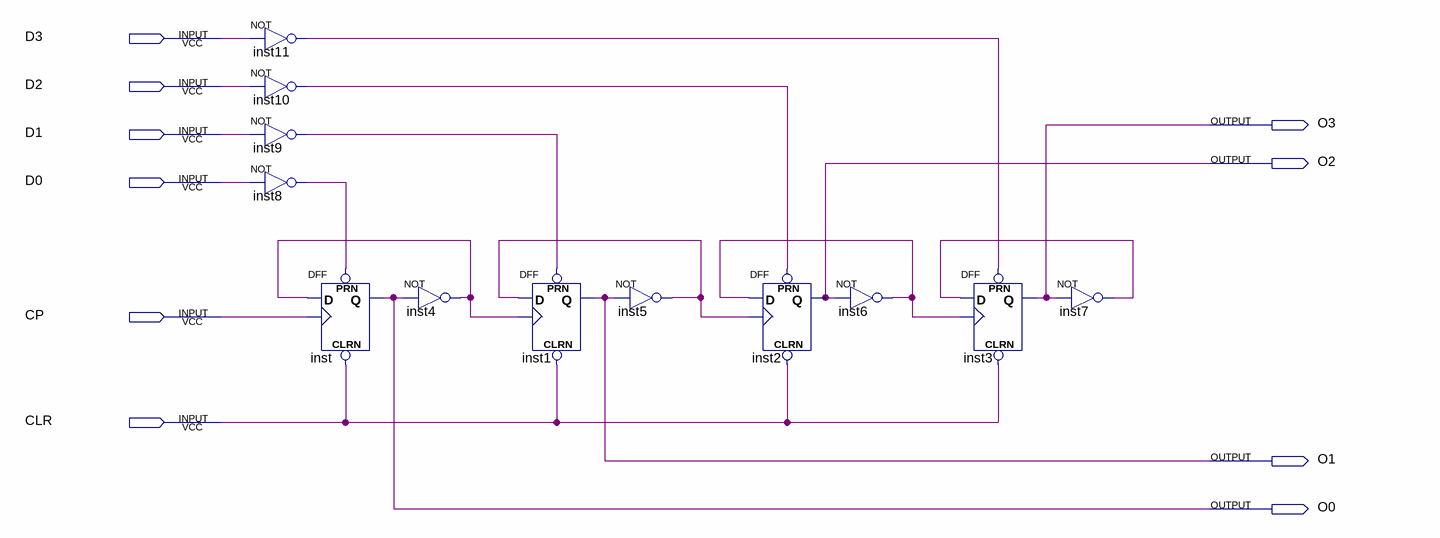
[diagram p0: schematic sheet]
// Quartus schematic preCounter-16.bdf as structural Verilog: 12 symbols, 10 pins
module \preCounter-16  (
  input  D3,
  input  D2,
  input  D1,
  input  D0,
  input  CP,
  input  CLR,
  output O3,
  output O2,
  output O1,
  output O0
);

  wire inst4_out, inst5_out, inst6_out, inst7_out, inst8_out, inst9_out, inst10_out, inst11_out;

  not inst11 (inst11_out, D3);
  not inst10 (inst10_out, D2);
  not inst9 (inst9_out, D1);
  not inst8 (inst8_out, D0);
  DFF inst (.CLRN(CLR), .CLK(CP), .D(inst4_out), .PRN(inst8_out), .Q(O0));
  not inst4 (inst4_out, O0);
  DFF inst1 (.CLRN(CLR), .CLK(inst4_out), .D(inst5_out), .PRN(inst9_out), .Q(O1));
  not inst5 (inst5_out, O1);
  DFF inst2 (.CLRN(CLR), .CLK(inst5_out), .D(inst6_out), .PRN(inst10_out), .Q(O2));
  not inst6 (inst6_out, O2);
  DFF inst3 (.CLRN(CLR), .CLK(inst6_out), .D(inst7_out), .PRN(inst11_out), .Q(O3));
  not inst7 (inst7_out, O3);
endmodule
